# Altium schematic sheet BARC_mounting_circuitry.SchDoc
size A4
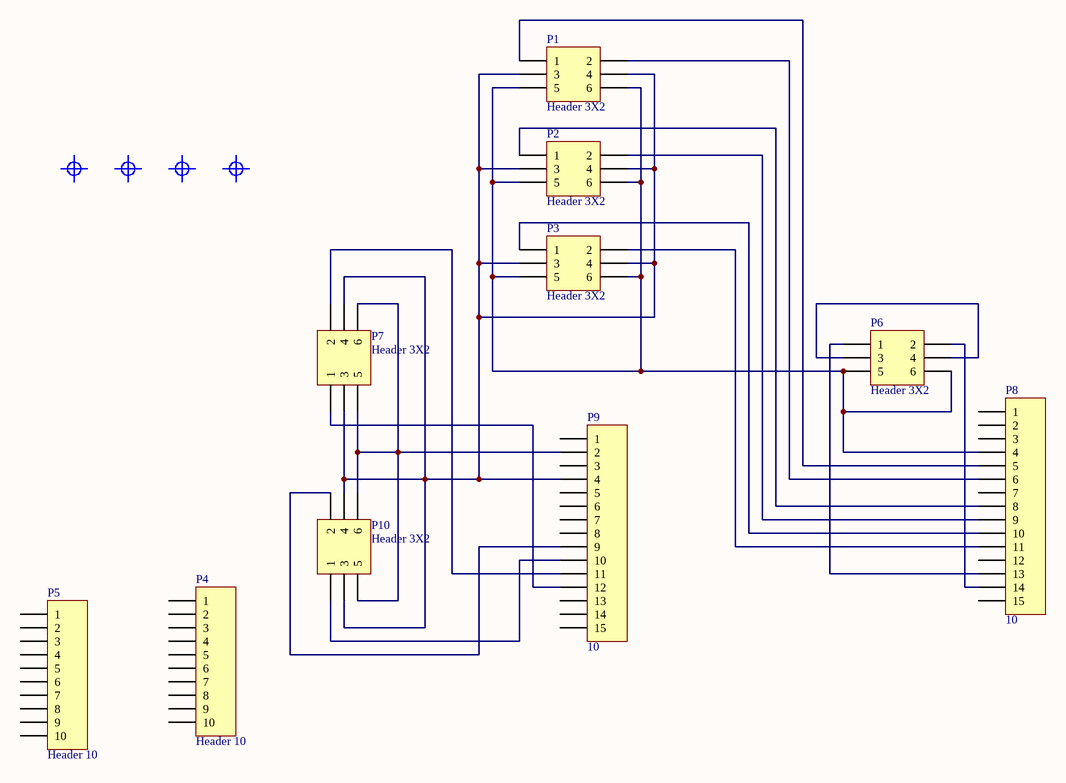
[diagram p0: BARC_mounting_circuitry.SchDoc]

## Parts
MP1  Mounting hole M2  [mh_m2]  (value not drawn)  (no BOM)
MP2  Mounting hole M2  [mh_m2]  (value not drawn)  (no BOM)
MP3  Mounting hole M2  [mh_m2]  (value not drawn)  (no BOM)
MP4  Mounting hole M2  [mh_m2]  (value not drawn)  (no BOM)
P1  Header 3X2  [HDR2X3]
P2  Header 3X2  [HDR2X3]
P3  Header 3X2  [HDR2X3]
P4  Header 10  [HDR1X10]
P5  Header 10  [HDR1X10]
P6  Header 3X2  [HDR2X3]
P7  Header 3X2  [HDR2X3]
P8  10  [HDR1X15]
P9  10  [HDR1X15]
P10  Header 3X2  [HDR2X3]

## Nets
NetP1_1: P1.1 P8.5
NetP1_2: P1.2 P8.6
NetP1_3: P1.3 P1.4 P2.3 P2.4 P3.3 P3.4 P7.3 P7.4 P9.4 P10.3 P10.4
NetP1_5: P1.5 P1.6 P2.5 P2.6 P3.5 P3.6 P6.5 P6.6 P8.4
NetP2_1: P2.1 P8.8
NetP2_2: P2.2 P8.9
NetP3_1: P3.1 P8.10
NetP3_2: P3.2 P8.11
NetP6_1: P6.1 P8.13
NetP6_2: P6.2 P8.14
NetP6_3: P6.3 P6.4
NetP7_1: P7.1 P9.12
NetP7_2: P7.2 P9.11
NetP7_5: P7.5 P7.6 P9.2 P10.5 P10.6
NetP9_9: P9.9 P10.2
NetP9_10: P9.10 P10.1

Not connected (* = marked no-connect by the designer): P4 1 2 3 4 5 6 7 8 9 10; P5 1 2 3 4 5 6 7 8 9 10; P8 1 2 3 7 12 15; P9 1 3 5 6 7 8 13 14 15

## Library data of the parts
MP1-MP4 = Mounting hole M2: Hole for M2 srews
P1-P3 P6 P7 P10 = Header 3X2: Header, 3-Pin, Dual row
P4 P5 = Header 10: Header, 10-Pin; LatestRevisionDate: 17-Jul-2002; LatestRevisionNote: Re-released for DXP Platform.; Publisher: Altium Limited
P8 P9 = Header 15: Header, 15-Pin